# EAGLE design fet_overdrive_v50 (EAGLE 9.6.2)
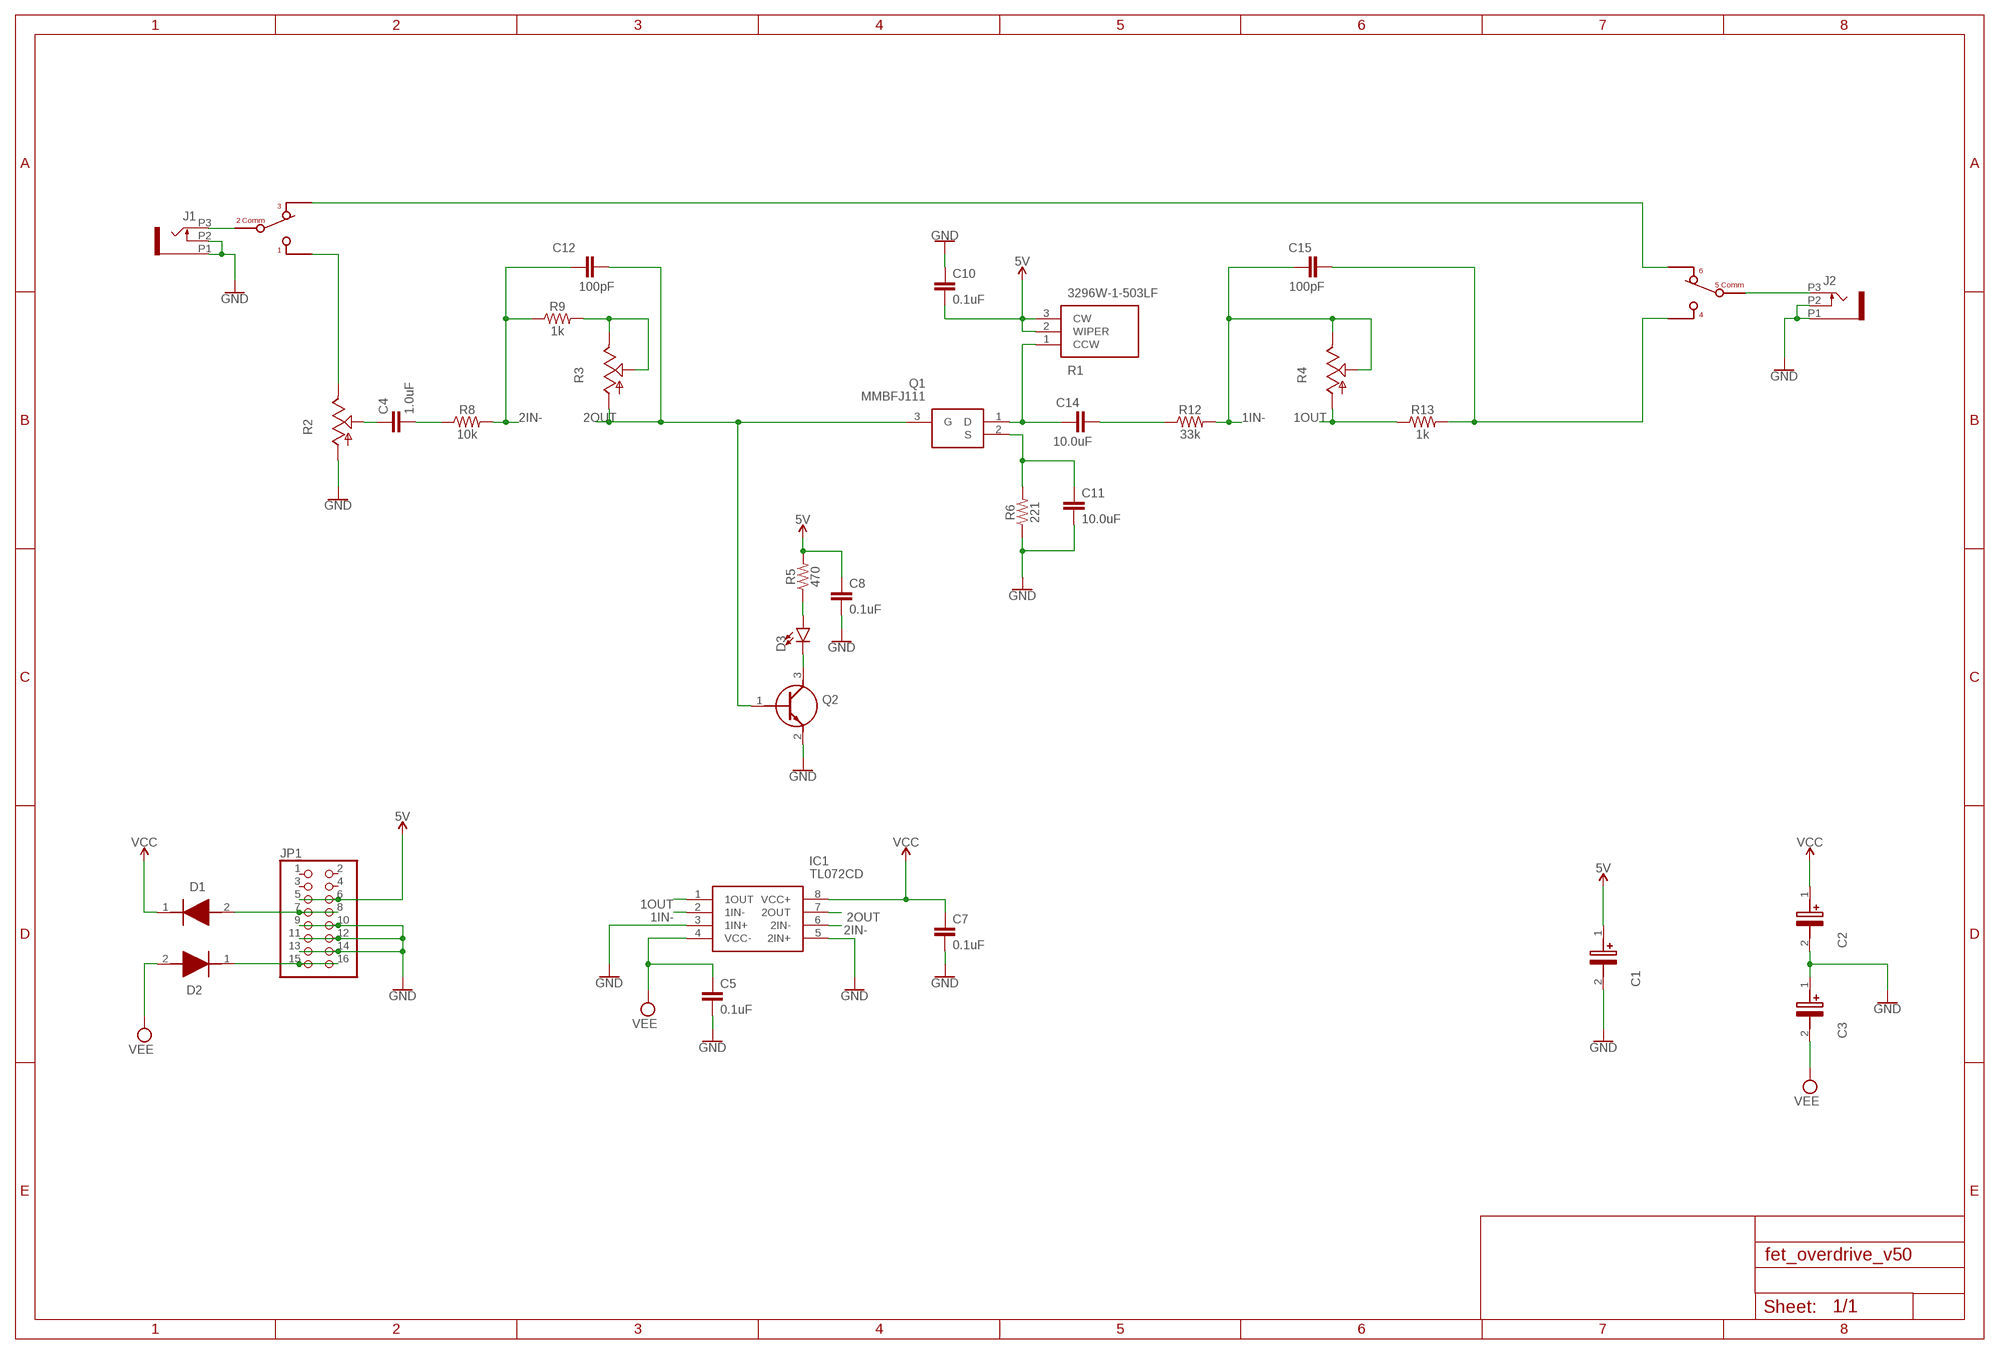
[diagram p0: schematic, sheet 1]

## Parts
C1  EEE-FP1E220AR  [EEE0GA101SR]
C2  EEE-FK1V470P  [EEE1AA101SP]
C3  EEE-FK1V470P  [EEE1AA101SP]
C4  1.0uF  1.0UF-0603-16V-10%  [0603]
C5  0.1uF  0.1UF-0603-25V-5%  [0603]
C7  0.1uF  0.1UF-0603-25V-5%  [0603]
C8  0.1uF  0.1UF-0603-25V-5%  [0603]
C10  0.1uF  0.1UF-0603-25V-5%  [0603]
C11  10.0uF  1.0UF-0603-16V-10%  [0603]
C12  100pF  100PF-0603-50V-5%  [0603]
C14  10.0uF  1.0UF-0603-16V-10%  [0603]
C15  100pF  100PF-0603-50V-5%  [0603]
D1  1N5819HW-7-F  [SOD3716X145N]
D2  1N5819HW-7-F  [SOD3716X145N]
D3  LED3MM  [LED_3MM]
IC1  TL072CD  [SOIC127P600X175-8N]
J1  PJ301_THONKICONN6  [WQP_PJ_301M6]
J2  PJ301_THONKICONN6  [WQP_PJ_301M6]
JP1  PINHD-2X8  [2X08]
Q1  MMBFJ111  [SOT96P237X111-3N]
Q2  SMMBT3904LT1G  [SOT96P237X111-3N]
R1  3296W-1-503LF  [3296W-1]
R2  POT_USVERTICAL_PS  [ALPS_POT_VERTICAL_PS]
R3  POT_USVERTICAL_PS  [ALPS_POT_VERTICAL_PS]
R4  POT_USVERTICAL_PS  [ALPS_POT_VERTICAL_PS]
R5  470  470OHM-0603-1/10W-1%  [0603]
R6  221  1KOHM-0603-1/10W-1%  [0603]
R8  10k  10KOHM-0603-1/10W-1%  [0603]
R9  1k  1KOHM-0603-1/10W-1%  [0603]
R12  33k  33KOHM-0603-1/10W-1%  [0603]
R13  1k  1KOHM-0603-1/10W-1%  [0603]
U$2  DAILYWELL-DPDT  [DAILYWELL-DPDT]

## Nets
1IN-: C15.1 IC1.2(1IN-) R4.P$1(E) R4.P$2(S) R12.2
1OUT: IC1.1(1OUT) R4.P$3(A) R13.1
2IN-: C12.1 IC1.6(2IN-) R8.2 R9.1
2OUT: C12.2 IC1.7(2OUT) Q1.3(G) Q2.1(B) R3.P$3(A)
5V: C1.1(+) C8.1 C10.2 JP1.5 JP1.6 R1.2(WIPER) R1.3(CW) R5.2
GND: C1.2(-) C2.2(-) C3.1(+) C5.2 C7.2 C8.2 C10.1 C11.2 IC1.3(1IN+) IC1.5(2IN+) J1.P1 J1.P2 J2.P1 J2.P2 JP1.9 JP1.10 JP1.11 JP1.12 JP1.13 JP1.14 Q2.2(E) R2.P$3(A) R6.1
N$1: C15.2 R13.2 U$2.P$4
N$2: J1.P3 U$2.P$2
N$3: D1.2(A) JP1.7 JP1.8
N$4: C4.1 R2.P$2(S)
N$5: C14.1 Q1.1(D) R1.1(CCW)
N$6: R2.P$1(E) U$2.P$1
N$7: D3.A R5.1
N$8: D3.K(C) Q2.3(C)
N$9: C4.2 R8.1
N$10: D2.1(K) JP1.15 JP1.16
N$11: C14.2 R12.1
N$13: C11.1 Q1.2(S) R6.2
N$14: R3.P$1(E) R3.P$2(S) R9.2
N$15: U$2.P$3 U$2.P$6
N$17: J2.P3 U$2.P$5
VCC: C2.1(+) C7.1 D1.1(K) IC1.8(VCC+)
VEE: C3.2(-) C5.1 D2.2(A) IC1.4(VCC-)
Unconnected: JP1.1 JP1.2 JP1.3 JP1.4

## Library data of the parts
C1 = EEE-FP1E220AR:EEE-FP1E220AR: PANASONIC - EEEFP1E220AR - SMD Aluminium Electrolytic Capacitor, Radial Can - SMD, 22 F, 25 V, 0.36 ohm, FP Series Source: Datasheet <http://industrial.panasonic.com/cdbs/www-data/pdf/RDE0000/ABA0000C1184.pdf>; DESCRIPTION: PANASONIC - EEEFP1E220AR - SMD Aluminium Electrolytic Capacitor, Radial Can - SMD, 22 F, 25 V, 0.36 ohm, FP Series; HEIGHT: 6.5mm; MANUFACTURER_NAME: Panasonic; MANUFACTURER_PART_NUMBER: EEE-FP1E220AR; MOUSER_PART_NUMBER: 667-EEE-FP1E220AR; MOUSER_PRICE-STOCK: https://www.mouser.co.uk/ProductDetail/Panasonic/EEE-FP1E220AR?qs=d1CqaRUMZD%252ByxlCLn0gmaw%3D%3D
C2 C3 = EEE-FK1V470P:EEE-FK1V470P: Aluminum Electrolytic Capacitors - SMD 47uF 35V Source: Datasheet <http://industrial.panasonic.com/cdbs/www-data/pdf/RDE0000/ABA0000C1181.pdf>; DESCRIPTION: Aluminum Electrolytic Capacitors - SMD 47uF 35V; HEIGHT: 7.8mm; MANUFACTURER_NAME: Panasonic; MANUFACTURER_PART_NUMBER: EEE-FK1V470P; MOUSER_PART_NUMBER: 667-EEE-FK1V470P; MOUSER_PRICE-STOCK: https://www.mouser.co.uk/ProductDetail/Panasonic/EEE-FK1V470P?qs=qE6bgDGEOCuVUX5CkiabHQ%3D%3D
C4 = SparkFun-Capacitors:1.0UF: 1µF ceramic capacitors A capacitor is a passive two-terminal electrical component used to store electrical energy temporarily in an electric field.; PROD_ID: CAP-00868
C5 C7 C8 C10 = SparkFun-Capacitors:0.1UF: 0.1µF ceramic capacitors A capacitor is a passive two-terminal electrical component used to store electrical energy temporarily in an electric field.; PROD_ID: CAP-08604
C11 C14 = SparkFun-Capacitors:1.0UF: 1µF ceramic capacitors A capacitor is a passive two-terminal electrical component used to store electrical energy temporarily in an electric field.; PROD_ID: CAP-00868; VALUE: 1.0uF
C12 C15 = SparkFun-Capacitors:100PF: 100pF/0.1nF ceramic capacitors A capacitor is a passive two-terminal electrical component used to store electrical energy temporarily in an electric field.; PROD_ID: CAP-07883
D1 D2 = 1N5819HW-7-F:1N5819HW-7-F: Diode Schottky 1A 40V SOD123 Diodes Inc 1N5819HW-7-F, SMT Schottky Diode, 40V 1A, 2-Pin SOD-123 Source: Datasheet <https://datasheet.datasheetarchive.com/originals/distributors/Datasheets-DGA23/1390892.pdf>; DESCRIPTION: Diode Schottky 1A 40V SOD123 Diodes Inc 1N5819HW-7-F, SMT Schottky Diode, 40V 1A, 2-Pin SOD-123; HEIGHT: 1.45mm; MANUFACTURER_NAME: Diodes Inc.; MANUFACTURER_PART_NUMBER: 1N5819HW-7-F; MOUSER_PART_NUMBER: 621-1N5819HW-F; MOUSER_PRICE-STOCK: https://www.mouser.co.uk/ProductDetail/Diodes-Incorporated/1N5819HW-7-F?qs=NQ47qNm99eDyWTEd07miYA%3D%3D
D3 = SparkFun-LED:LED: LED (Generic) Standard schematic elements and footprints for 5mm, 3mm, 1206, and 0603 sized LEDs. Generic LEDs with no color specified.; PROD_ID: DIO-08794
IC1 = TL072CD:TL072CD: Dual Low-Noise JFET-Input General-Purpose Operational Amplifier Source: Datasheet <http://www.ti.com/lit/ds/symlink/tl072.pdf>; DESCRIPTION: Dual Low-Noise JFET-Input General-Purpose Operational Amplifier; HEIGHT: 1.75mm; MANUFACTURER_NAME: Texas Instruments; MANUFACTURER_PART_NUMBER: TL072CD; MOUSER_PART_NUMBER: 595-TL072CD; MOUSER_PRICE-STOCK: https://www.mouser.co.uk/ProductDetail/Texas-Instruments/TL072CD?qs=5nGYs9Do7G0niDPig1J2Tw%3D%3D
J1 J2 = og-pj301_variations:PJ301_THONKICONN
JP1 = pinhead:PINHD-2X8: PIN HEADER
Q1 = MMBFJ111:MMBFJ111: ON Semiconductor MMBFJ111 N-channel JFET Transistor, 15 V, Idss 20mA, 3-Pin SOT-23 Source: Datasheet <http://www.onsemi.com/pub/Collateral/318-08.PDF>; DESCRIPTION: ON Semiconductor MMBFJ111 N-channel JFET Transistor, 15 V, Idss 20mA, 3-Pin SOT-23; HEIGHT: 1.11mm; MANUFACTURER_NAME: onsemi; MANUFACTURER_PART_NUMBER: MMBFJ111; MOUSER_PART_NUMBER: 512-MMBFJ111; MOUSER_PRICE-STOCK: https://www.mouser.co.uk/ProductDetail/onsemi-Fairchild/MMBFJ111?qs=ljbEvF4DwON7frgBCN%2FB1Q%3D%3D
Q2 = SMMBT3904LT1G:SMMBT3904LT1G: General Purpose Transistor NPN Silicon Source: Datasheet <https://www.onsemi.com/pub/Collateral/MMBT3904LT1-D.PDF>; DESCRIPTION: General Purpose Transistor NPN Silicon; HEIGHT: 1.11mm; MANUFACTURER_NAME: onsemi; MANUFACTURER_PART_NUMBER: SMMBT3904LT1G; MOUSER_PART_NUMBER: 863-SMMBT3904LT1G; MOUSER_PRICE-STOCK: https://www.mouser.co.uk/ProductDetail/onsemi/SMMBT3904LT1G?qs=SHm1gYoUFFxP0E8RxmhUgw%3D%3D
R1 = 3296W-1-503LF:3296W-1-503LF: 3296W top adj cermet trimmer,50K 10mm Bourns 3296W Series 25-Turn Through Hole Cermet Trimmer Resistor with Pin Terminations, 50k +/-10% 1/2W +/-100ppm/C Source: Datasheet <http://www.bourns.com/docs/Product-Datasheets/3296.pdf>; DESCRIPTION: 3296W top adj cermet trimmer,50K 10mm Bourns 3296W Series 25-Turn Through Hole Cermet Trimmer Resistor with Pin Terminations, 50k +/-10% 1/2W +/-100ppm/C; HEIGHT: mm; MANUFACTURER_NAME: Bourns; MANUFACTURER_PART_NUMBER: 3296W-1-503LF; MOUSER_PART_NUMBER: 652-3296W-1-503LF; MOUSER_PRICE-STOCK: https://www.mouser.co.uk/ProductDetail/Bourns/3296W-1-503LF?qs=NmEazmuVvbVy5cO6T2zGYQ%3D%3D
R2-R4 = og-pots:POT_US
R5 = SparkFun-Resistors:470OHM: 470Ω resistor A resistor is a passive two-terminal electrical component that implements electrical resistance as a circuit element. Resistors act to reduce current flow, and, at the same time, act to lower voltage levels within circuits. - Wikipedia; PROD_ID: RES-07869
R6 = SparkFun-Resistors:1KOHM: 1kΩ resistor A resistor is a passive two-terminal electrical component that implements electrical resistance as a circuit element. Resistors act to reduce current flow, and, at the same time, act to lower voltage levels within circuits. - Wikipedia; PROD_ID: RES-07856; VALUE: 1k
R8 = SparkFun-Resistors:10KOHM: 10kΩ resistor A resistor is a passive two-terminal electrical component that implements electrical resistance as a circuit element. Resistors act to reduce current flow, and, at the same time, act to lower voltage levels within circuits. - Wikipedia; PROD_ID: RES-00824
R9 R13 = SparkFun-Resistors:1KOHM: 1kΩ resistor A resistor is a passive two-terminal electrical component that implements electrical resistance as a circuit element. Resistors act to reduce current flow, and, at the same time, act to lower voltage levels within circuits. - Wikipedia; PROD_ID: RES-07856
R12 = SparkFun-Resistors:33KOHM: 33kΩ resistor A resistor is a passive two-terminal electrical component that implements electrical resistance as a circuit element. Resistors act to reduce current flow, and, at the same time, act to lower voltage levels within circuits. - Wikipedia; PROD_ID: RES-08416
U$2 = Graphics_v38:DAILYWELL-DPDT

## Board
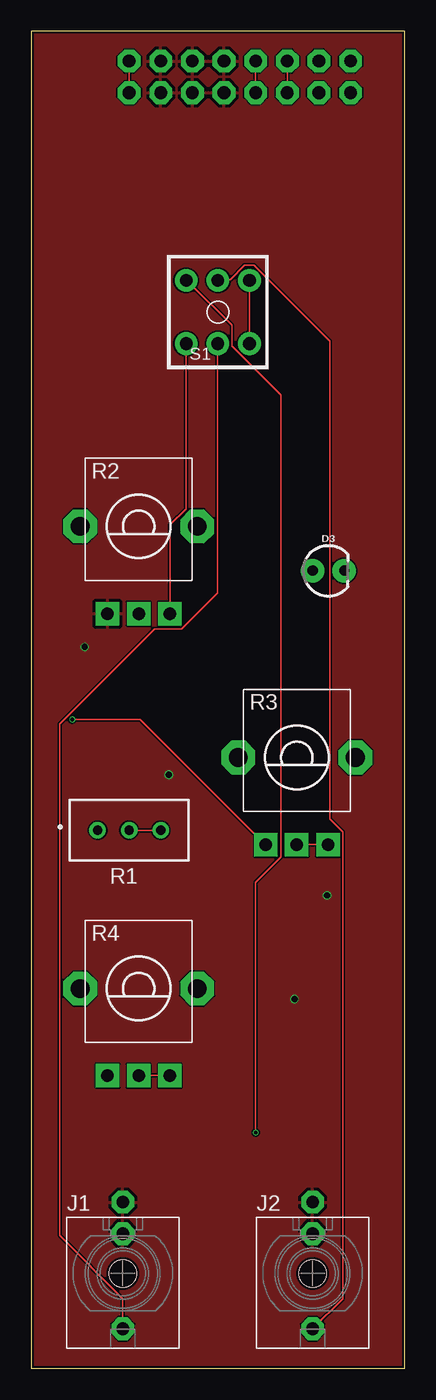
[diagram p1: board, top side]
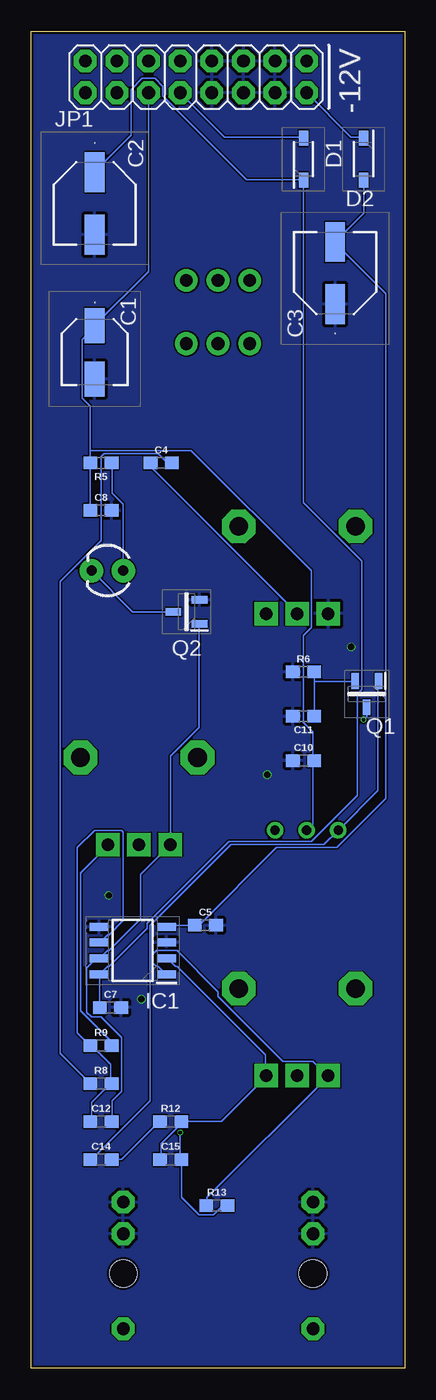
[diagram p2: board, bottom side, seen from below]

Size 30 x 107.3 mm. Coordinates in mm from the lower left corner, seen from the top.
Outline: 0,0 30,0 30,107.3 0,107.3 0,0
Copper layers (1*16): Top 0.035mm / dielectric 1.6mm / Bottom 0.035mm
Design rules "jlcpcb-2layers": minimum track width 5mil, minimum drill 0.3mm, track to track 5mil, track to pad 5mil, pad to pad 5mil, via to via 5mil, smd to smd 5mil, copper to edge 0.2mm, drill to drill 6mil, minimum pad ring 10mil, minimum via ring 3mil, stop-mask expansion 4mil, vias tented up to drill 0mil, thermal gap 10mil

### Footprints (pad centres in the part's own frame; a part is rotated, then mirrored left to right if it is on the bottom)
EEE0GA101SR = smd 2.8 x 1.6: 1 -2.15,0; 2 2.15,0
EEE1AA101SP = smd 3.2 x 1.6: 1 -2.5,0; 2 2.5,0
0603 = smd 1.1 x 1: 1 -0.85,0; 2 0.85,0
SOD3716X145N = smd 1.2 x 0.75: 1 -1.7,0; 2 1.7,0
LED_3MM = drill 0.813 pad 1.88: A -1.27,0; K 1.27,0
SOIC127P600X175-8N = smd 1.528 x 0.65: 1 -2.711,1.905; 2 -2.711,0.635; 3 -2.711,-0.635; 4 -2.711,-1.905; 5 2.711,-1.905; 6 2.711,-0.635; 7 2.711,0.635; 8 2.711,1.905
WQP_PJ_301M6 = drill 1.016 pad 1.778 octagon: P1 0,-5.715; P2 0,-3.175; P3 0,4.445 | hole 2.2: 0,0
2X08 = drill 1.016 octagon: 1 -8.89,-1.27; 2 -8.89,1.27; 3 -6.35,-1.27; 4 -6.35,1.27; 5 -3.81,-1.27; 6 -3.81,1.27; 7 -1.27,-1.27; 8 -1.27,1.27; 9 1.27,-1.27; 10 1.27,1.27; 11 3.81,-1.27; 12 3.81,1.27; 13 6.35,-1.27; 14 6.35,1.27; 15 8.89,-1.27; 16 8.89,1.27
SOT96P237X111-3N = smd 1.25 x 0.6: 1 -1.05,0.955; 2 -1.05,-0.955; 3 1.05,0
3296W-1 = drill 0.74 pad 1.24: 1 -2.54,0; 2 0,0; 3 2.54,0
ALPS_POT_VERTICAL_PS = drill 1 pad 1.88 square: P$1 -2.5,7; P$2 0,7; P$3 2.5,7 | drill 1.5 pad 2.54 octagon: P$4 -4.7,0; P$5 4.7,0
DAILYWELL-DPDT = drill 1.016: P$1 -2.546,-2.54; P$2 -0.006,-2.54; P$3 2.534,-2.54; P$4 -2.546,2.54; P$5 -0.006,2.54; P$6 2.534,2.54

### Placement (x,y rotation side)
C1  24.89,81.53 270 bottom
C2  24.89,93.47 270 bottom
C3  5.59,87.88 90 bottom
C4  19.56,72.64 0 bottom
C5  16,35.56 0 bottom
C7  23.62,28.96 0 bottom
C8  24.38,68.83 0 bottom
C10  8.13,48.77 0 bottom
C11  8.13,52.32 180 bottom
C12  24.38,19.81 0 bottom
C14  24.38,16.76 0 bottom
C15  18.8,16.76 0 bottom
D1  8.13,97.03 90 bottom
D2  3.3,97.03 270 bottom
D3  23.88,64.01 0 top
IC1  21.84,33.53 180 bottom
J1  7.37,7.62 180 top
J2  22.61,7.62 180 top
JP1  16.76,103.63 0 bottom
Q1  3.05,54.1 270 bottom
Q2  17.53,60.71 180 bottom
R1  7.87,43.18 0 top
R2  8.64,67.56 180 top
R3  21.34,49.02 180 top
R4  8.64,30.48 180 top
R5  24.38,72.64 180 bottom
R6  8.13,55.88 0 bottom
R8  24.38,22.86 0 bottom
R9  24.38,25.91 0 bottom
R12  18.8,19.81 0 bottom
R13  15.09,13.08 0 bottom
U$2  15,84.76 0 top

### Tracks (layer width: path | path; a pad name or v marks a point on that pad's centre or on a via)
1IN-
  Top 0.127: R4.P$2 8.64,23.5 11.05,23.5 R4.P$1
  Bottom 0.127: C15.1 19.56,16.76 19.56,18.03 18.03,19.56 18.03,19.81 R12.2 14.73,19.81 11.18,23.37 R4.P$1 11.18,23.5 11.18,25.15 18.29,32.26 18.41,32.26 19.05,32.89 IC1.2
1OUT
  Bottom 0.127: R13.1 15.88,13.08 15.88,13.72 6.22,23.37 R4.P$3 6.22,23.5 7.37,24.64 9.78,24.64 14.99,29.84 14.99,30.23 18.29,33.53 19.94,33.53 20.19,33.27 20.19,32.51 19.94,32.26 19.81,32.26 19.18,31.62 IC1.1
2IN-
  Bottom 0.127: 23.62,22.86 23.62,24.38 25.15,25.91 R9.1 25.27,25.91 26.29,26.92 26.29,41.78 24.89,43.18 22.73,43.18 22.61,43.05 22.61,35.94 23.75,34.8 23.88,34.8 24.51,34.16 IC1.6 | 23.62,22.86 25.15,21.34 25.15,19.81 C12.1 | 23.62,22.86 R8.2
2OUT  (via drill 0.3)
  Top 0.127: v3.3,52.07 8.76,52.07 18.8,42.04 R3.P$3
  Bottom 0.127: C12.2 23.5,19.81 23.5,21.46 22.73,22.23 22.73,26.54 24.38,28.19 25.15,28.19 25.53,28.57 25.53,32.13 24.77,32.89 IC1.7 24.51,32.89 23.88,33.53 23.75,33.53 21.21,36.07 21.21,39.62 18.92,41.91 R3.P$3 18.8,42.04 18.8,49.15 16.51,51.44 16.51,59.69 Q2.1 | Q1.3 3.05,52.32 v3.3,52.07
5V
  Top 0.127: R1.2 R1.3 | JP1.6 JP1.5
  Bottom 0.127: 7.37,48.77 7.37,43.69 R1.2 | 25.27,72.64 25.27,68.83 C8.1 | 25.27,73.66 25.27,77.22 25.91,77.85 25.91,82.55 24.89,83.57 C1.1 24.89,83.69 20.57,88.01 JP1.5 | 25.27,73.66 25.27,72.64 | 25.27,72.64 R5.2 | 7.37,48.77 7.37,51.05 8.13,51.82 8.13,58.8 7.49,59.44 7.49,64.01 17.14,73.66 25.27,73.66 | 7.37,48.77 C10.2
GND  (via drill 0.51)
  other vias: 21.15,29.62 4.3,57.89 11.05,47.64 23.77,37.95
  pour Top: 0,0 0,107.3 30,107.3 30,0
  pour Bottom: 0,0 0,107.3 30,107.3 30,0
N$1  (via drill 0.3)
  Top 0.127: v18.03,18.92 18.03,38.99 20.07,41.02 20.07,78.11 16.13,82.04 16.13,83.69 12.57,87.25 U$2.P$4
  Bottom 0.127: R13.2 14.35,12.95 14.73,12.95 15.37,12.32 16.51,12.32 17.91,13.72 17.91,16.76 C15.2 18.03,16.76 v18.03,18.92
N$2
  Top 0.127: J1.P3 7.37,5.59 2.29,10.67 2.29,51.69 9.91,59.31 12.06,59.31 14.99,62.23 14.99,82.17 U$2.P$2
N$3
  Top 0.127: JP1.7 JP1.8
  Bottom 0.127: JP1.7 14.48,98.81 8.13,98.81 D1.2
N$4
  Bottom 0.127: C4.1 20.32,72.64 20.32,72.26 8.64,60.58 R2.P$2
N$5
  Bottom 0.127: C14.1 25.15,16.76 20.45,21.46 20.45,35.56 13.97,42.04 6.48,42.04 R1.1 2.16,46.35 2.16,55.12 Q1.1
N$6
  Top 0.127: U$2.P$1 12.45,82.17 12.45,68.96 11.18,67.69 11.18,60.58 R2.P$1
N$7
  Bottom 0.127: D3.A 22.61,69.34 23.5,70.23 23.5,72.64 R5.1
N$8
  Bottom 0.127: Q2.3 21.84,60.71 D3.K
N$9
  Bottom 0.127: C4.2 19.05,72.64 19.81,73.41 24.13,73.41 24.38,73.15 24.38,66.42 27.69,63.12 27.69,25.27 25.27,22.86 R8.1
N$10
  Top 0.127: JP1.15 JP1.16
  Bottom 0.127: JP1.15 4.32,98.81 3.3,98.81 D2.1
N$11
  Bottom 0.127: C14.2 22.73,16.76 19.68,19.81 R12.1
N$13
  Bottom 0.127: 7.24,55.12 7.24,55.88 R6.2 | 7.24,55.12 7.24,52.32 C11.1 | 7.24,55.12 4.06,55.12 Q1.2
N$14
  Top 0.127: R3.P$2 21.34,42.04 23.75,42.04 R3.P$1
  Bottom 0.127: R9.2 23.62,25.91 23.62,26.29 26.04,28.7 26.04,39.75 23.88,41.91 R3.P$1
N$15
  Top 0.127: U$2.P$3 17.53,82.3 17.53,87.25 U$2.P$6
N$17
  Top 0.127: J2.P3 25.02,5.59 25.02,43.05 24,44.07 24,82.42 17.91,88.52 17.14,88.52 16,87.38 15.11,87.38 U$2.P$5
VCC
  Bottom 0.127: 24.51,31.62 24.51,28.96 C7.1 | C2.1 24.89,96.01 21.97,98.93 21.97,102.62 21.08,103.5 20.07,103.5 19.43,102.87 19.43,102.11 12.7,95.38 8.13,95.38 D1.1 8.13,69.47 3.43,64.77 3.43,54.48 3.81,54.1 3.81,45.97 7.49,42.29 14.1,42.29 20.7,35.69 20.7,35.31 23.75,32.26 23.88,32.26 24.51,31.62 | 24.51,31.62 IC1.8
VEE
  Bottom 0.127: IC1.4 19.05,35.43 18.92,35.56 C5.1 16.51,35.56 10.29,41.78 5.46,41.78 1.52,45.72 1.52,86.23 5.59,90.3 C3.2 5.59,90.42 3.3,92.71 D2.2

### Text on the board
tPlace: S1
bPlace: -12V